# Altium project inverter_board.PrjPcb
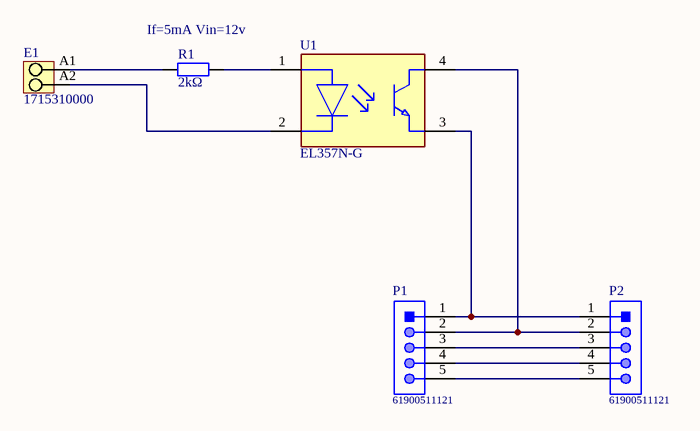
[diagram p0: inverter_board.SchDoc]
1 sheet, 5 parts. Net scope: global (net labels, ports and power ports of the same name join across sheets).
Board file: inverter_board.PcbDoc

## Sheet inverter_board.SchDoc
size A4

### Parts
E1  1715310000  [LM_5_00_90_02]
P1  61900511121  [61900511121]
P2  61900511121  [61900511121]
R1  2kΩ  [RES_0805]
U1  EL357N-G  [SOP-4_4mm]

### Nets
NetE1_A1: E1.A1 R1.1
NetE1_A2: E1.A2 U1.2(C)
NetP1_1: P1.1 P2.1 U1.3(E)
NetP1_2: P1.2 P2.2 U1.4(C)
NetP1_3: P1.3 P2.3
NetP1_4: P1.4 P2.4
NetP1_5: P1.5 P2.5
NetR1_2: R1.2 U1.1(A)

### Notes on the sheet
- (near R1) If=5mA Vin=12v

### Library data of the parts
E1 = CMP-1559-01745-1: OMNIMATE Signal - series LM; Manufacturer: Weidmueller; Contact_material: Cu-Leg; Contact_surface: tinned; Solder_pin_length_mm: 3,5 mm; Rated_voltage_for_surge_voltage_class_pollution_degree_II_2: 630 V; Short_text_for_material: LM 5.00/02/90 3.5SN OR BX; Pitch_inch: 0,197 inch; Pitch_mm: 5 mm; Wire_cross_section_AWG_min_UL_1059: AWG 24; No_of_poles: 2; Side_termination_characteristic: closed side; UL_94_flammability_rating: V-0; Mounting_onto_the_PCB: Solder connection; Rated_voltage_use_group_B_UL_1059: 300 V; Insulating_material: Wemid (PA); Solid_min_H05_07_V_U: 0,2 mm²; Rated_current_use_group_B_UL_1059: 15 A; Wire_cross_section_AWG_max_UL_1059: AWG 14; Solid_max_H05_07_V_U: 2,5 mm²; PartNumber: 1715310000; ComponentLink2Description: URL Link1; Revision: V1; ComponentLink1Description: Manufacturer URL; ComponentLink2URL: http://catalog.weidmueller.com/catalog/Start.do?localeId=en&ObjectID=1715310000; PackageReference: LM_5_00_90_02; Qty: 500 PCS; Colour: Orange; ComponentLink1URL: http://www.weidmueller.com/; Packaging: Box
P1 P2 = CMP-1502-00587-1: Male Locking Header WR-WTB, THT, Vertical, pitch 2.54 mm, 1 x 5 position; Manufacturer: Wurth Elektronik; Pitch: 2.54mm; Contact Resistance: 20mOhm; Position: 1x5; Working Voltage: 250VAC; Publisher: WurthElektronik; Datasheet URL: https://katalog.we-online.de/em/datasheet/6190xx11121.pdf; Part Number: 61900511121; Manufacturer URL: http://www.we-online.de; Gender: Male; Mounting Technology: THT; Package Reference: 61900511121; Operating Temperature: -40to105degC; Orientation: Vertical; Packaging: Bag
R1 = RES_100kohm_0805: Res Thick Film 0805 100K Ohm 1% 0.125W(1/8W) ±100ppm/°C Molded SMD Punched Carrier T/R; Manufacturer: Panasonic; Manufacturer Part Number: ERJ-6ENF1003V; Resistance: 100kR; Max Power Dissipation: 125mW; Voltage Rating (DC): 150V; Supplier 1: Mouser; RoHS: Yes; Category: Chip SMD Resistors; Stock 1: 3449; Pricing 1: 1=0.11000, 10=0.08300, 50=0.08300, 100=0.03200, 1000=0.01400, 2500=0.01300, 5000=0.01000, 10000=0.01000 (USD); Mount: Surface Mount; Case/Package: 0805; Number of Pins: 2; Case Code (Metric): 2012; Case Code (Imperial): 0805; Contact Plating: Tin; Min Operating Temperature: -55°C; Max Operating Temperature: 155°C; Tolerance: 1%; Packaging: Tape and Reel; Number of Terminations: 2; Temperature Coefficient: 100ppm/°C; Resistor Type: Thick Film; Features: Automotive AEC-Q200; Power Rating: 125mW; Package Quantity: 1; Voltage Rating: 150V; Termination: SMD/SMT; Length: 2mm; Width: 0.049inch; Height: 0.6mm; Depth: 1.25mm; Radiation Hardening: No; Lead Free: Lead Free; Military Standard: Not; REACH SVHC: No SVHC; ComponentLink1URL: https://datasheet.ciiva.com/11821/0900766b80f80784-11821507.pdf?src-supplier=RSComponents; ComponentLink1Description: https://datasheet.ciiva.com/11821/0900766b80f80784-11821507.pdf?src-supplier=RSComponents; ComponentLink2URL: https://datasheet.ciiva.com/22723/426256-22723909.pdf?src-supplier=Element14; ComponentLink2Description: https://datasheet.ciiva.com/22723/426256-22723909.pdf?src-supplier=Element14; ComponentLink3URL: https://datasheet.ciiva.com/46419/1678782-46419877.pdf?src-supplier=Element14; ComponentLink3Description: https://datasheet.ciiva.com/46419/1678782-46419877.pdf?src-supplier=Element14; ComponentLink4URL: https://datasheet.ciiva.com/27055/1988989-27055734.pdf?src-supplier=Jameco; ComponentLink4Description: https://datasheet.ciiva.com/27055/1988989-27055734.pdf?src-supplier=Jameco; ComponentLink5URL: https://datasheet.ciiva.com/16449/aoa0000ce2-16449480.pdf?src-supplier=Future+Electronics; ComponentLink5Description: https://datasheet.ciiva.com/16449/aoa0000ce2-16449480.pdf?src-supplier=Future+Electronics; ComponentLink6URL: https://datasheet.ciiva.com/17208/aoa0000ce2-17208153.pdf?src-supplier=Avnet+Europe; ComponentLink6Description: https://datasheet.ciiva.com/17208/aoa0000ce2-17208153.pdf?src-supplier=Avnet+Europe; ComponentLink7URL: https://datasheet.ciiva.com/22667/1678782-22667897.pdf?src-supplier=Element14; ComponentLink7Description: https://datasheet.ciiva.com/22667/1678782-22667897.pdf?src-supplier=Element14; ComponentLink8URL: https://datasheet.ciiva.com/24023/aoa0000ce2-24023497.pdf?src-supplier=Mouser; ComponentLink8Description: https://datasheet.ciiva.com/24023/aoa0000ce2-24023497.pdf?src-supplier=Mouser; ComponentLink9URL: https://datasheet.ciiva.com/7830/426256-7830746.pdf?src-supplier=Element14; ComponentLink9Description: https://datasheet.ciiva.com/7830/426256-7830746.pdf?src-supplier=Element14; ComponentLink10URL: https://datasheet.ciiva.com/30257/aoa0000ce2-30257690.pdf?src-supplier=Onlinecomponents.com; ComponentLink10Description: https://datasheet.ciiva.com/30257/aoa0000ce2-30257690.pdf?src-supplier=Onlinecomponents.com; ComponentLink11URL: https://datasheet.ciiva.com/7830/426256-7830988.pdf?src-supplier=Element14; ComponentLink11Description: https://datasheet.ciiva.com/7830/426256-7830988.pdf?src-supplier=Element14; ComponentLink12URL: https://datasheet.ciiva.com/16776/70260748-16776892.pdf?src-supplier=Allied+Electronics; ComponentLink12Description: https://datasheet.ciiva.com/16776/70260748-16776892.pdf?src-supplier=Allied+Electronics; ComponentLink13URL: https://datasheet.ciiva.com/16788/70260748-16788734.pdf?src-supplier=Allied+Electronics; ComponentLink13Description: https://datasheet.ciiva.com/16788/70260748-16788734.pdf?src-supplier=Allied+Electronics; ComponentLink14URL: https://datasheet.ciiva.com/48531/aoa0000ce2-48531486.pdf?src-supplier=Avnet; ComponentLink14Description: https://datasheet.ciiva.com/48531/aoa0000ce2-48531486.pdf?src-supplier=Avnet; Supplier Part Number 1: 667-ERJ-6ENF1003V
U1 = OPTOCOUPLER_EL357N-G: 4 PIN SOP PHOTOTRANSISTOR PHOTOCOUPLER / CTR: 50~600% at IF =5mA, VCE =5V / 4 Pin SOP with a 2.0 mm profile; ComponentLink1Description: Datasheet; ComponentLink1URL: https://www.mouser.com/datasheet/2/143/201407061738295695-365680.pdf